# EAGLE design iot-terminal-shield (EAGLE 8.4.1)
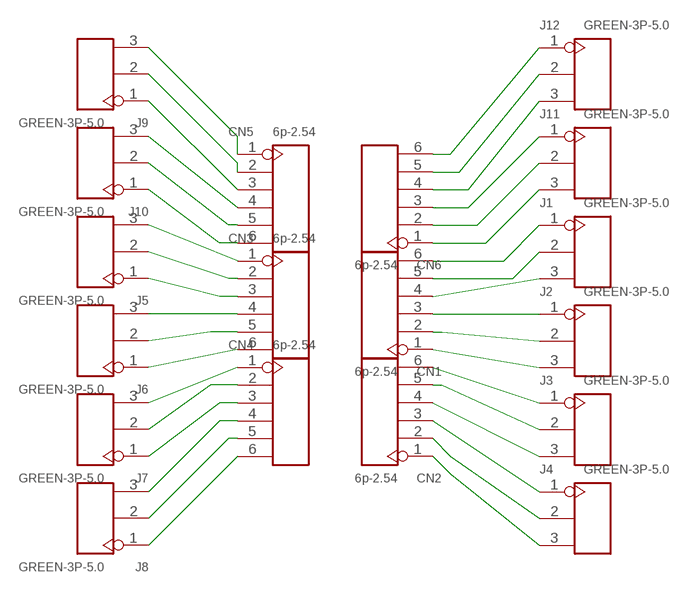
[diagram p0: schematic, sheet 1]

## Parts
CN1  6p-2.54  DIP-BLACK-FEMALE-HEADER-VERT(6P-2.54)  [H6-2.54]
CN2  6p-2.54  DIP-BLACK-FEMALE-HEADER-VERT(6P-2.54)  [H6-2.54]
CN3  6p-2.54  DIP-BLACK-FEMALE-HEADER-VERT(6P-2.54)  [H6-2.54]
CN4  6p-2.54  DIP-BLACK-FEMALE-HEADER-VERT(6P-2.54)  [H6-2.54]
CN5  6p-2.54  DIP-BLACK-FEMALE-HEADER-VERT(6P-2.54)  [H6-2.54]
CN6  6p-2.54  DIP-BLACK-FEMALE-HEADER-VERT(6P-2.54)  [H6-2.54]
J1  GREEN-3P-5.0  SCREW-TERMINAL-GREEN(3P-5.0)  [H3-5.0-15.5X8.0MM]
J2  GREEN-3P-5.0  SCREW-TERMINAL-GREEN(3P-5.0)  [H3-5.0-15.5X8.0MM]
J3  GREEN-3P-5.0  SCREW-TERMINAL-GREEN(3P-5.0)  [H3-5.0-15.5X8.0MM]
J4  GREEN-3P-5.0  SCREW-TERMINAL-GREEN(3P-5.0)  [H3-5.0-15.5X8.0MM]
J5  GREEN-3P-5.0  SCREW-TERMINAL-GREEN(3P-5.0)  [H3-5.0-15.5X8.0MM]
J6  GREEN-3P-5.0  SCREW-TERMINAL-GREEN(3P-5.0)  [H3-5.0-15.5X8.0MM]
J7  GREEN-3P-5.0  SCREW-TERMINAL-GREEN(3P-5.0)  [H3-5.0-15.5X8.0MM]
J8  GREEN-3P-5.0  SCREW-TERMINAL-GREEN(3P-5.0)  [H3-5.0-15.5X8.0MM]
J9  GREEN-3P-5.0  SCREW-TERMINAL-GREEN(3P-5.0)  [H3-5.0-15.5X8.0MM]
J10  GREEN-3P-5.0  SCREW-TERMINAL-GREEN(3P-5.0)  [H3-5.0-15.5X8.0MM]
J11  GREEN-3P-5.0  SCREW-TERMINAL-GREEN(3P-5.0)  [H3-5.0-15.5X8.0MM]
J12  GREEN-3P-5.0  SCREW-TERMINAL-GREEN(3P-5.0)  [H3-5.0-15.5X8.0MM]

## Nets
N$1: CN3.1 J5.3
N$2: CN3.2 J5.2
N$3: CN3.3 J5.1
N$4: CN3.4 J6.3
N$5: CN3.5 J6.2
N$6: CN3.6 J6.1
N$7: CN4.1 J7.3
N$8: CN4.2 J7.2
N$9: CN4.3 J7.1
N$10: CN4.4 J8.3
N$11: CN4.5 J8.2
N$12: CN4.6 J8.1
N$13: CN1.6 J1.1
N$14: CN1.5 J1.2
N$15: CN1.4 J1.3
N$16: CN1.3 J2.1
N$17: CN1.2 J2.2
N$18: CN1.1 J2.3
N$19: CN2.6 J3.1
N$20: CN2.5 J3.2
N$21: CN2.4 J3.3
N$22: CN2.3 J4.1
N$23: CN2.2 J4.2
N$24: CN2.1 J4.3
N$25: CN5.6 J10.1
N$26: CN5.5 J10.2
N$27: CN5.4 J10.3
N$28: CN6.1 J11.3
N$29: CN6.2 J11.2
N$30: CN6.3 J11.1
N$31: CN6.4 J12.3
N$32: CN6.5 J12.2
N$33: CN6.6 J12.1
N$34: CN5.3 J9.1
N$35: CN5.2 J9.2
N$36: CN5.1 J9.3

## Library data of the parts
CN1-CN6 = Seeed-Connector:DIP-BLACK-FEMALE-HEADER-VERT(6P-2.54): 320030060; MPN: F185-1106A1BSYC1
J1-J12 = Seeed-Connector:SCREW-TERMINAL-GREEN(3P-5.0): 320110029

## Board
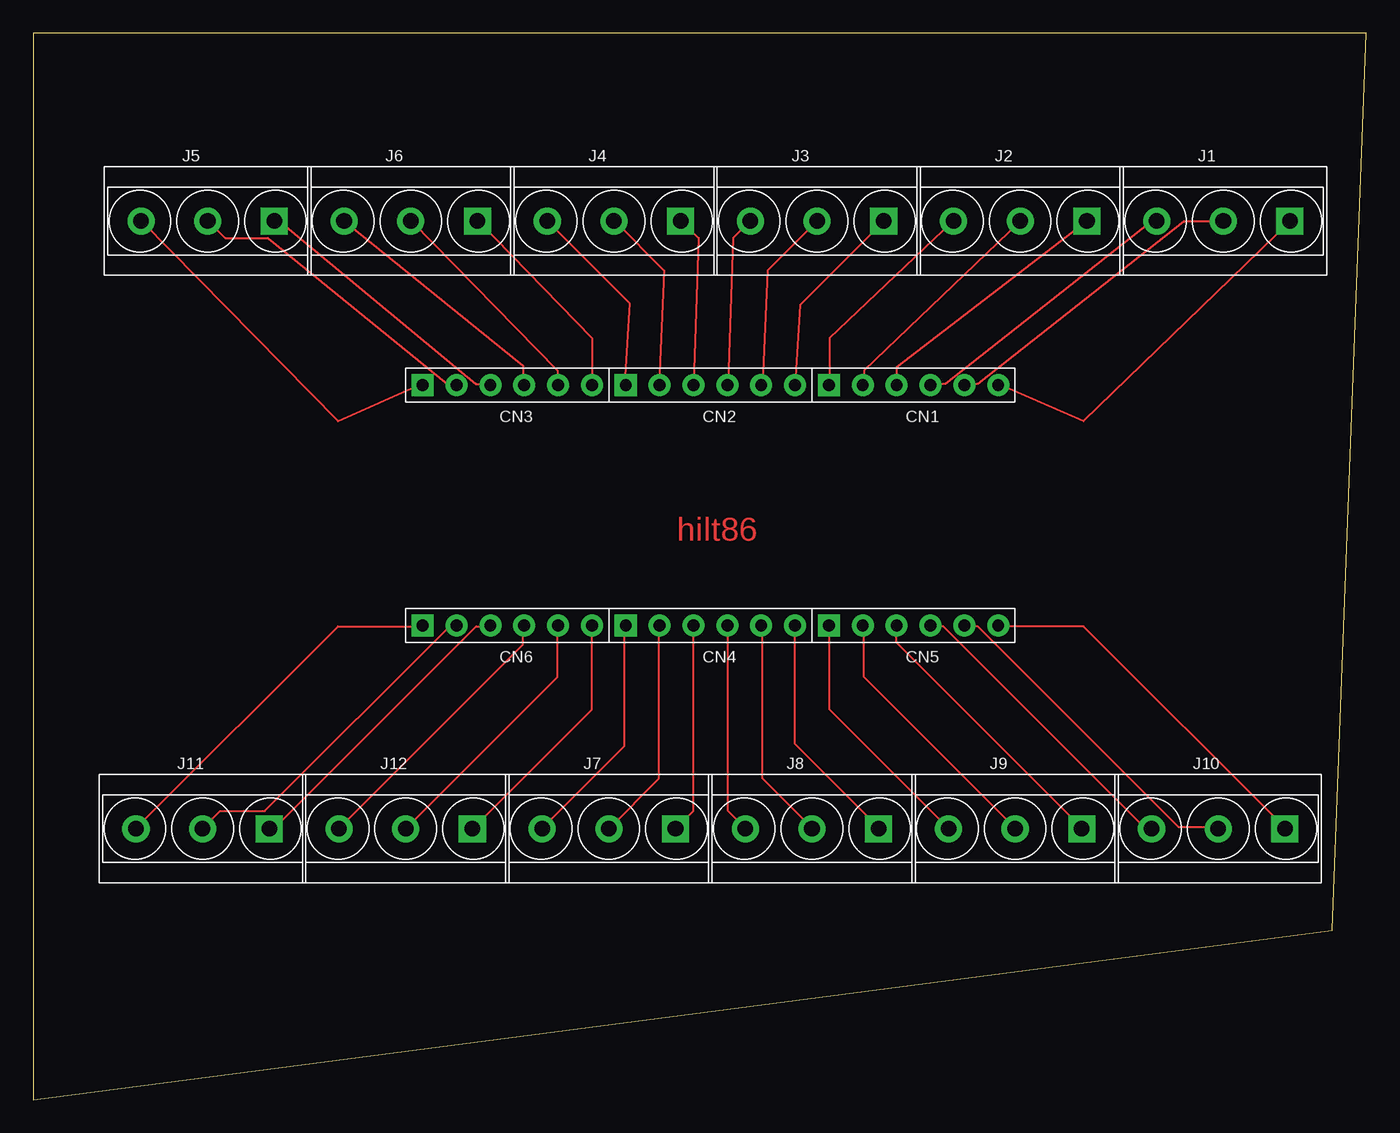
[diagram p1: board, top side]

Size 100 x 80 mm. Coordinates in mm from the lower left corner, seen from the top.
Outline: 0,0 97.46,12.7 100,80 0,80 0,0
Copper layers (1*16): Top 0.035mm / dielectric 1.5mm / Bottom 0.035mm
Design rules "default": minimum track width 6mil, minimum drill 0.35mm, track to track 6mil, track to pad 6mil, pad to pad 6mil, via to via 6mil, smd to smd 6mil, copper to edge 40mil, drill to drill 6mil, minimum pad ring 10mil, minimum via ring 8mil, stop-mask expansion 4mil, vias tented up to drill 0mil, thermal gap 10mil

### Footprints (pad centres in the part's own frame; a part is rotated, then mirrored left to right if it is on the bottom)
H6-2.54 = drill 0.889 pad 1.651 square: 1 0,6.35 | drill 0.889 pad 1.651: 2 0,3.81; 3 0,1.27; 4 0,-1.27; 5 0,-3.81; 6 0,-6.35
H3-5.0-15.5X8.0MM = drill 1.168 pad 2.032 square: 1 0,5 | drill 1.168 pad 2.032: 2 0,0; 3 0,-5

### Placement (x,y rotation side)
CN1  66.04,53.59 90 top
CN2  50.8,53.59 90 top
CN3  35.56,53.59 90 top
CN4  50.8,35.56 90 top
CN5  66.04,35.56 90 top
CN6  35.56,35.56 90 top
J1  89.28,65.91 270 top
J2  74.04,65.91 270 top
J3  58.8,65.91 270 top
J4  43.56,65.91 270 top
J5  13.08,65.91 270 top
J6  28.32,65.91 270 top
J7  43.18,20.32 270 top
J8  58.42,20.32 270 top
J9  73.66,20.32 270 top
J10  88.9,20.32 270 top
J11  12.7,20.32 270 top
J12  27.94,20.32 270 top

### Tracks (layer width: path | path; a pad name or v marks a point on that pad's centre or on a via)
N$1
  Top 0.152: CN3.1 29.11,53.7 22.86,50.9 8.15,65.86 J5.3
N$2
  Top 0.152: CN3.2 31.7,53.7 31.09,53.7 17.6,64.64 14.4,64.64 13.18,65.86 J5.2
N$3
  Top 0.152: CN3.3 34.29,53.7 33.22,53.7 18.52,65.86 18.21,65.86 J5.1
N$4
  Top 0.152: CN3.4 36.73,53.7 36.73,55.07 23.39,65.86 J6.3
N$5
  Top 0.152: CN3.5 39.32,53.7 39.32,54.71 28.42,65.86 J6.2
N$6
  Top 0.152: CN3.6 41.91,57.15 33.45,65.86 J6.1
N$7
  Top 0.152: CN4.1 44.35,35.51 44.35,26.52 38.25,20.42 J7.3
N$8
  Top 0.152: J7.2 46.94,24.08 46.94,35.51 CN4.2
N$9
  Top 0.152: CN4.3 49.53,21.64 48.31,20.42 J7.1
N$10
  Top 0.152: CN4.4 52.12,35.51 52.12,21.64 53.34,20.42 J8.3
N$11
  Top 0.152: CN4.5 54.71,35.51 54.71,24.08 58.37,20.42 J8.2
N$12
  Top 0.152: CN4.6 57.15,26.67 63.4,20.42 J8.1
N$13
  Top 0.152: CN1.6 72.39,53.7 78.79,50.9 94.26,65.86 J1.1
N$14
  Top 0.152: CN1.5 69.95,53.7 70.87,53.7 86.33,65.86 89.23,65.86 J1.2
N$15
  Top 0.152: CN1.4 67.36,53.7 68.43,53.7 83.9,65.86 84.2,65.86 J1.3
N$16
  Top 0.152: CN1.3 64.77,54.91 79.02,65.86 J2.1
N$17
  Top 0.152: J2.2 62.33,54.71 62.33,53.7 CN1.2
N$18
  Top 0.152: CN1.1 59.74,53.7 59.74,57.15 68.96,65.86 J2.3
N$19
  Top 0.152: CN2.6 57.53,59.61 63.78,65.86 J3.1
N$20
  Top 0.152: J3.2 55.09,62.2 54.71,53.7 CN2.5
N$21
  Top 0.152: CN2.4 52.12,53.7 52.5,64.64 53.72,65.86 J3.3
N$22
  Top 0.152: CN2.3 49.91,64.64 48.69,65.86 J4.1
N$23
  Top 0.152: CN2.2 46.94,53.7 47.32,62.2 43.66,65.86 J4.2
N$24
  Top 0.152: CN2.1 44.35,53.7 44.73,59.77 38.63,65.86 J4.3
N$25
  Top 0.152: CN5.6 72.39,35.51 78.79,35.51 93.88,20.42 J10.1
N$26
  Top 0.152: CN5.5 69.95,35.51 70.87,35.51 85.95,20.42 88.85,20.42 J10.2
N$27
  Top 0.152: CN5.4 67.36,35.51 68.28,35.51 83.36,20.42 83.82,20.42 J10.3
N$28
  Top 0.152: CN6.1 29.11,35.51 22.86,35.51 7.77,20.42 J11.3
N$29
  Top 0.152: J11.2 14.02,21.64 17.37,21.64 31.24,35.51 31.7,35.51 CN6.2
N$30
  Top 0.152: CN6.3 34.29,35.51 33.22,35.51 18.14,20.42 17.83,20.42 J11.1
N$31
  Top 0.152: CN6.4 36.73,35.51 36.73,34.14 23.01,20.42 J12.3
N$32
  Top 0.152: J12.2 39.32,31.7 39.32,35.51 CN6.5
N$33
  Top 0.152: CN6.6 41.91,29.26 33.07,20.42 J12.1
N$34
  Top 0.152: CN5.3 64.77,34.29 78.64,20.42 J9.1
N$35
  Top 0.152: CN5.2 62.33,35.51 62.33,31.7 73.61,20.42 J9.2
N$36
  Top 0.152: CN5.1 59.74,35.51 59.74,29.26 68.58,20.42 J9.3

### Text on the board
Top: hilt86